# EAGLE schematic VDA (EAGLE 9.6.2)
VERSION: 1.1

## Sheet 1 of 5: Isolated USB-UART Bridge
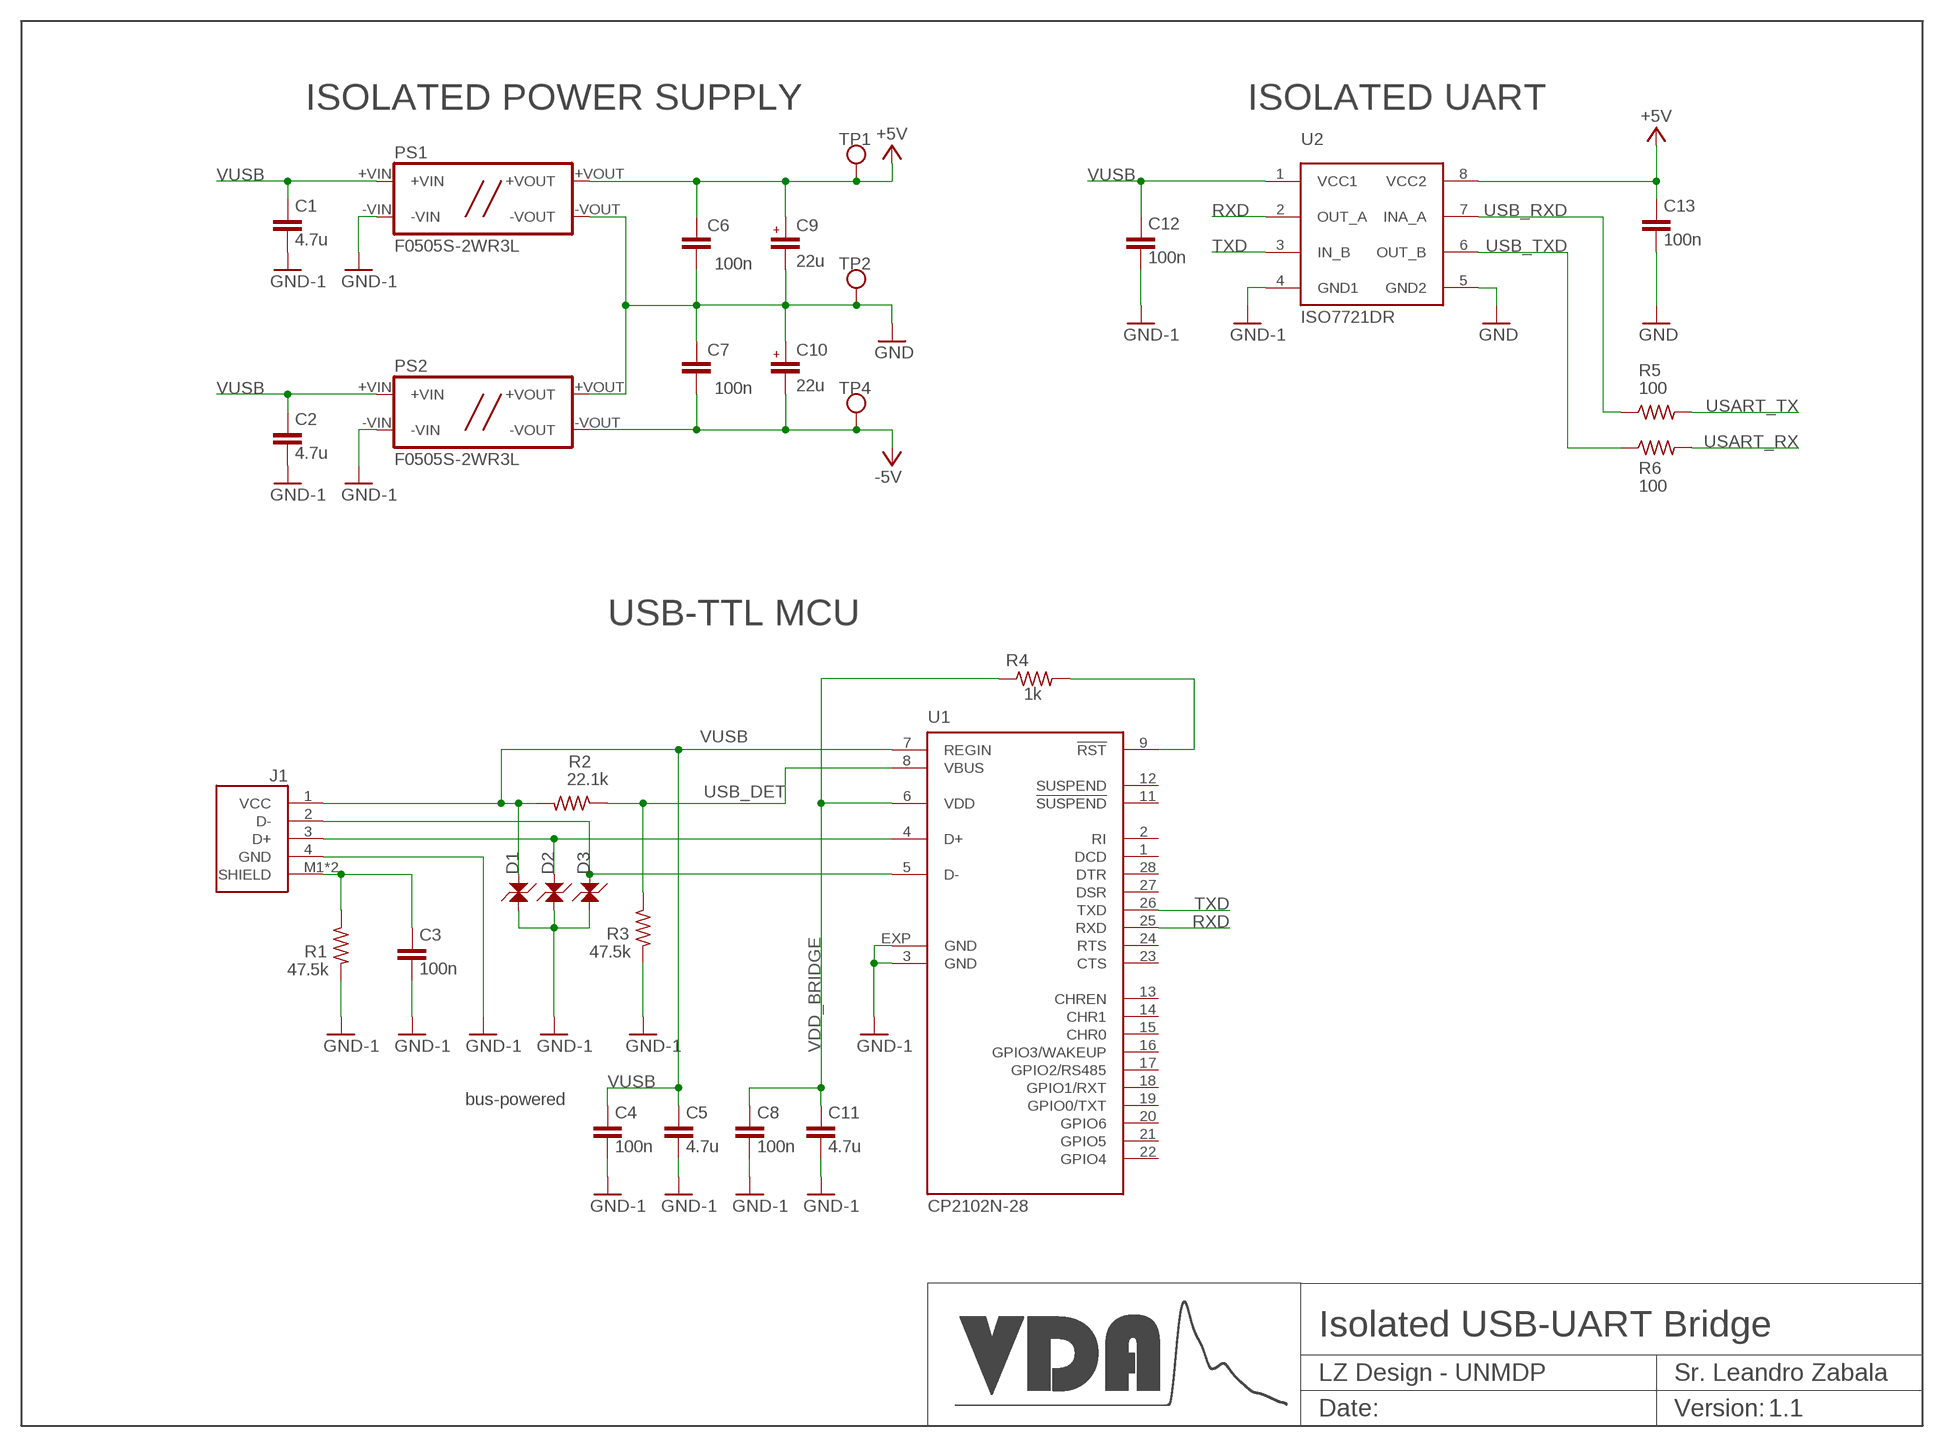
[diagram p0: schematic, sheet 1]

### Parts
C1  4.7u  C_0805  [C_0805]
C2  4.7u  C_0805  [C_0805]
C3  100n  C_0603  [C_0603]
C4  100n  C_0603  [C_0603]
C5  4.7u  C_0805  [C_0805]
C6  100n  C_0603  [C_0603]
C7  100n  C_0603  [C_0603]
C8  100n  C_0603  [C_0603]
C9  22u  C-ELECT-6.3X5.4  [CAPAE660X590N]
C10  22u  C-ELECT-6.3X5.4  [CAPAE660X590N]
C11  4.7u  C_0805  [C_0805]
C12  100n  C_0603  [C_0603]
C13  100n  C_0603  [C_0603]
D1  LESD5D5.0CT1G  [SOD523]
D2  LESD5D5.0CT1G  [SOD523]
D3  LESD5D5.0CT1G  [SOD523]
J1  USB-2.0  [USB-B]
PS1  F0505S-2WR3L  ISOLATED_DCDC  [0505S-2WR3]
PS2  F0505S-2WR3L  ISOLATED_DCDC  [0505S-2WR3]
R1  47.5k  R-US_R0402  [R0402]
R2  22.1k  R-US_R0402  [R0402]
R3  47.5k  R-US_R0402  [R0402]
R4  1k  R-US_R0402  [R0402]
R5  100  R_0603  [R_0603]
R6  100  R_0603  [R_0603]
TP1  HOLE_0.8MM  [HOLE_0.8MM]
TP2  HOLE_0.8MM  [HOLE_0.8MM]
TP4  HOLE_0.8MM  [HOLE_0.8MM]
U1  CP2102N-28  [MLP28]
U2  ISO7721DR  [SO8]

### Nets
+5V: C6.P$1 C9.+ C13.P$1 PS1.+VOUT TP1.1(P) U2.8(VCC2) ; also sheet 2,4,5
-5V: C7.P$2 C10.- PS2.-VOUT TP4.1(P) ; also sheet 4,5
GND: C6.P$2 C7.P$1 C9.- C10.+ C13.P$2 PS1.-VOUT PS2.+VOUT TP2.1(P) U2.5(GND2) ; also sheet 2,3,4,5
GND-1: C1.P$2 C2.P$2 C3.P$2 C4.P$2 C5.P$2 C8.P$2 C11.P$2 C12.P$2 D1.C D2.C D3.C J1.4(GND) PS1.-VIN PS2.-VIN R1.2 R3.2 U1.3(GND) U1.EXP(GND) U2.4(GND1)
N$54: R4.2 U1.9(!RST)
RXD: U1.25(RXD) U2.2(OUT_A)
SHIELD: C3.P$1 J1.M1(SHIELD) J1.M2(SHIELD) R1.1
TXD: U1.26(TXD) U2.3(IN_B)
USART_RX: R6.2 ; also sheet 3
USART_TX: R5.2 ; also sheet 3
USB_DET: R2.1 R3.1 U1.8(VBUS)
USB_DN: D3.A J1.2(D-) U1.5(D-)
USB_DP: D2.A J1.3(D+) U1.4(D+)
USB_RXD: R5.1 U2.7(INA_A)
USB_TXD: R6.1 U2.6(OUT_B)
VDD_BRIDGE: C8.P$1 C11.P$1 R4.1 U1.6(VDD)
VUSB: C1.P$1 C2.P$1 C4.P$1 C5.P$1 C12.P$1 D1.A J1.1(VCC) PS1.+VIN PS2.+VIN R2.2 U1.7(REGIN) U2.1(VCC1)
Unconnected: U1.1(DCD) U1.2(RI) U1.11(!SUSPEND) U1.12(SUSPEND) U1.13(CHREN) U1.14(CHR1) U1.15(CHR0) U1.16(GPIO3/WAKEUP) U1.17(GPIO2/RS485) U1.18(GPIO1/RXT) U1.19(GPIO0/TXT) U1.20(GPIO6) U1.21(GPIO5) U1.22(GPIO4) U1.23(CTS) U1.24(RTS) U1.27(DSR) U1.28(DTR)

### Notes on the sheet
- ISOLATED POWER SUPPLY | ISOLATED UART
- USB-TTL MCU
- bus-powered

## Sheet 2 of 5: LDO and Voltage Reference
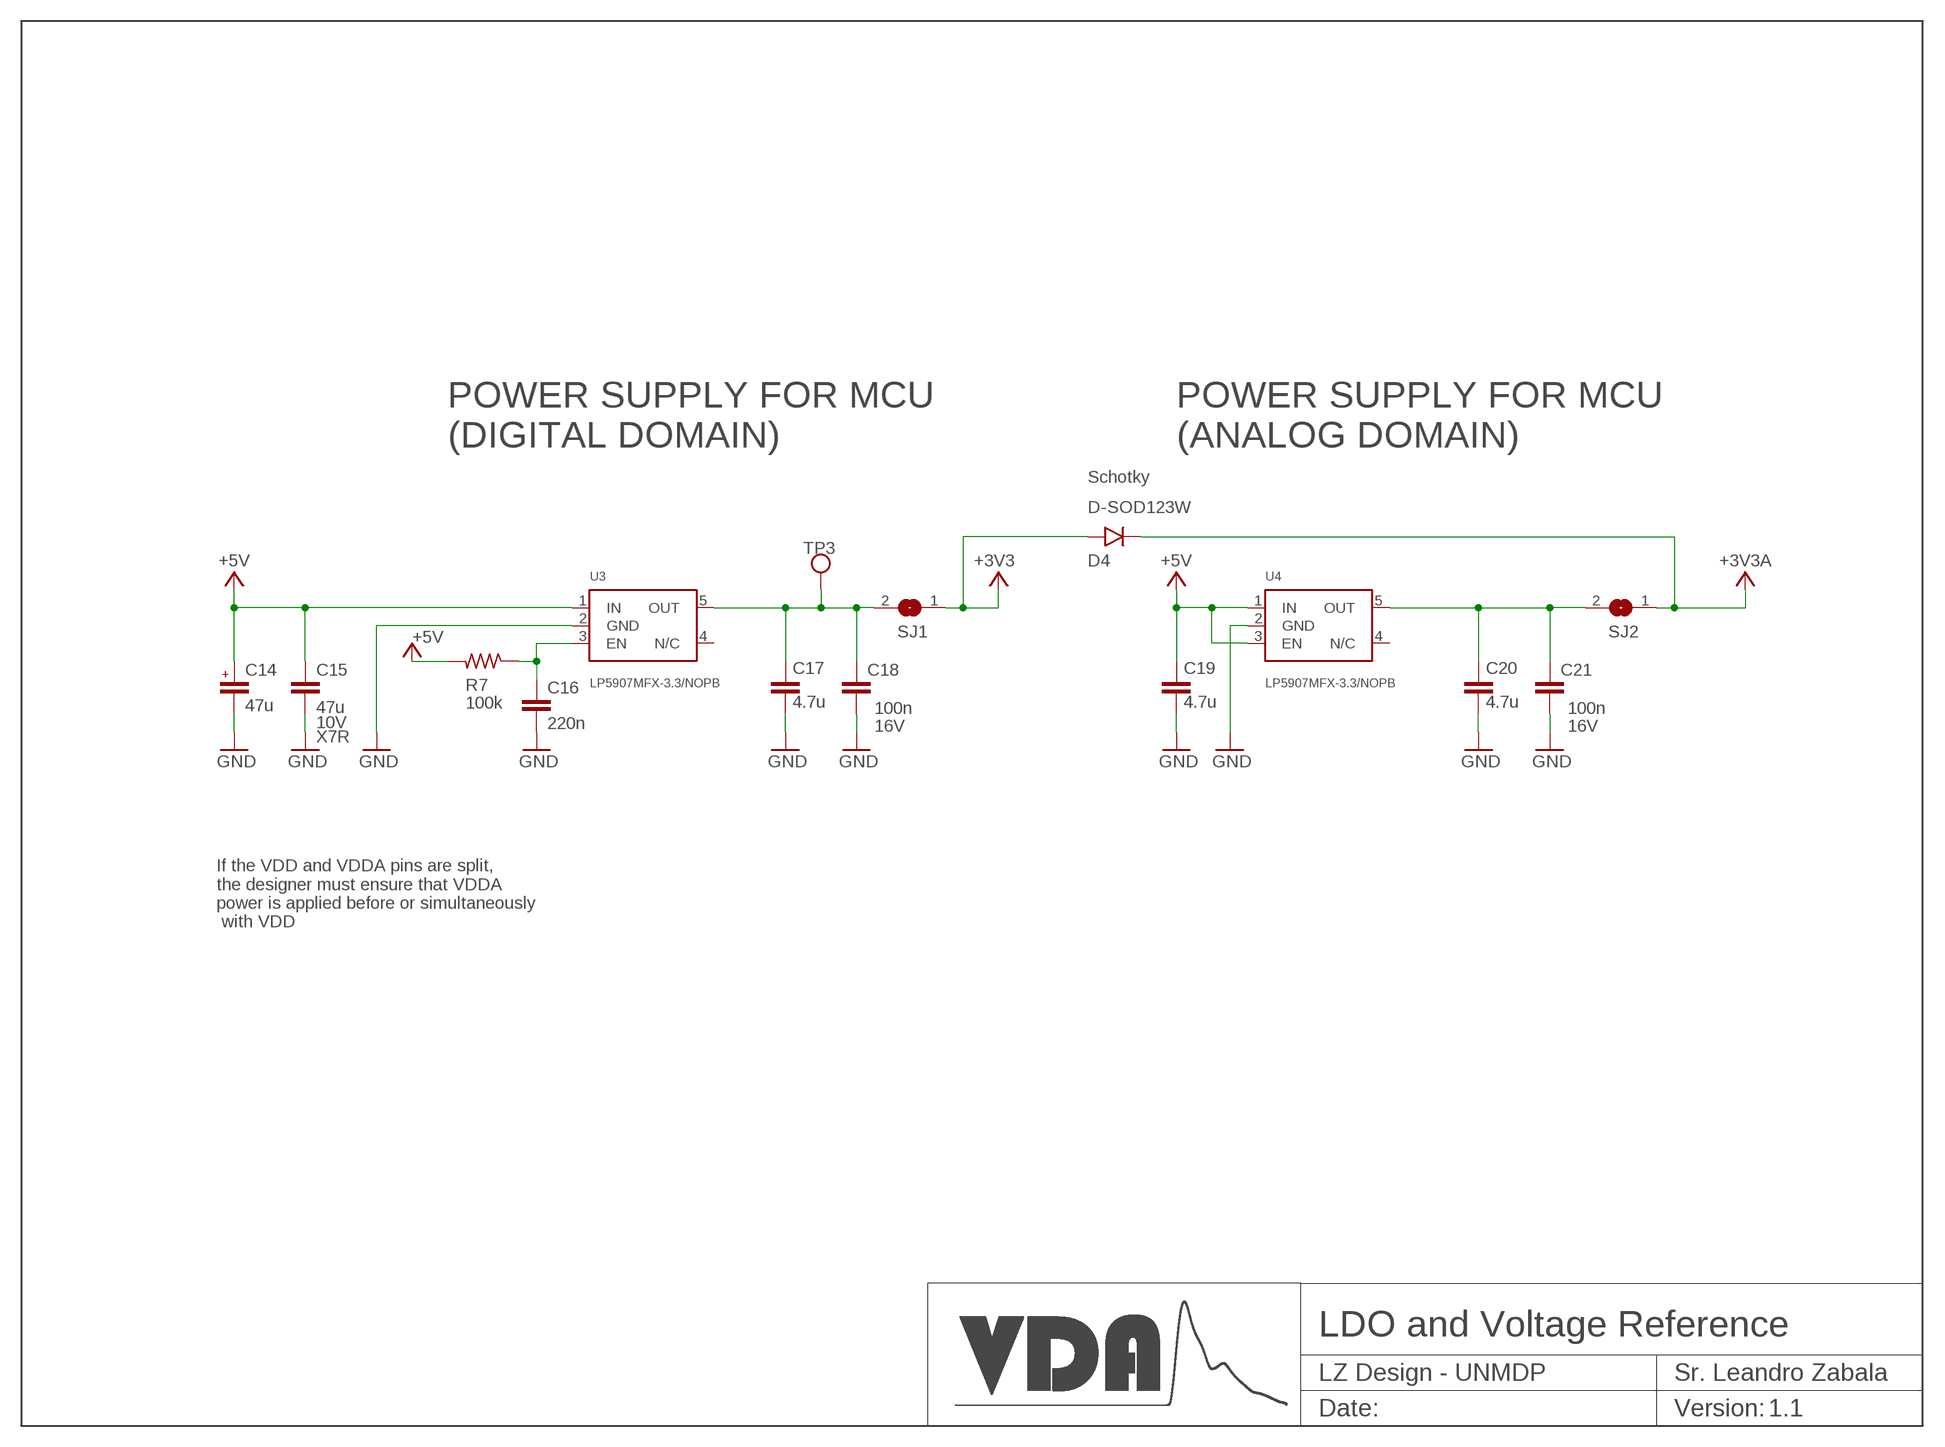
[diagram p1: schematic, sheet 2]

### Parts
C14  47u  C-TANTALUM_A_3216  [A_3216]
C15  47u  C_1206  [C_1206]
C16  220n  C_0603  [C_0603]
C17  4.7u  C_0805  [C_0805]
C18  100n  C_0603  [C_0603]
C19  4.7u  C_0805  [C_0805]
C20  4.7u  C_0805  [C_0805]
C21  100n  C_0603  [C_0603]
D4  D-SOD123W  [SOD123W]
R7  100k  R_0603  [R_0603]
SJ1  SJ  [SJ]
SJ2  SJ  [SJ]
TP3  HOLE_0.8MM  [HOLE_0.8MM]
U3  LP5907MFX-3.3/NOPB  LDO1SOT23-5_1  [SOT23-5]
U4  LP5907MFX-3.3/NOPB  LDO1SOT23-5_1  [SOT23-5]

### Nets
+3V3: D4.A SJ1.1 ; also sheet 3,5
+3V3A: D4.C(K) SJ2.1 ; also sheet 3,4,5
+5V: C14.A(+) C15.P$1 C19.P$1 R7.2 U3.1(IN) U4.1(IN) U4.3(EN) ; also sheet 1,4,5
GND: C14.K(-) C15.P$2 C16.P$2 C17.P$2 C18.P$2 C19.P$2 C20.P$2 C21.P$2 U3.2(GND) U4.2(GND) ; also sheet 1,3,4,5
N$1: C17.P$1 C18.P$1 SJ1.2 TP3.1(P) U3.5(OUT)
N$46: C16.P$1 R7.1 U3.3(EN)
N$50: C20.P$1 C21.P$1 SJ2.2 U4.5(OUT)
Unconnected: U3.4(N/C) U4.4(N/C)

### Notes on the sheet
- POWER SUPPLY FOR MCU
  (DIGITAL DOMAIN)
- POWER SUPPLY FOR MCU
  (ANALOG DOMAIN)
- If the VDD and VDDA pins are split,
  the designer must ensure that VDDA 
  power is applied before or simultaneously
   with VDD

## Sheet 3 of 5: MCU
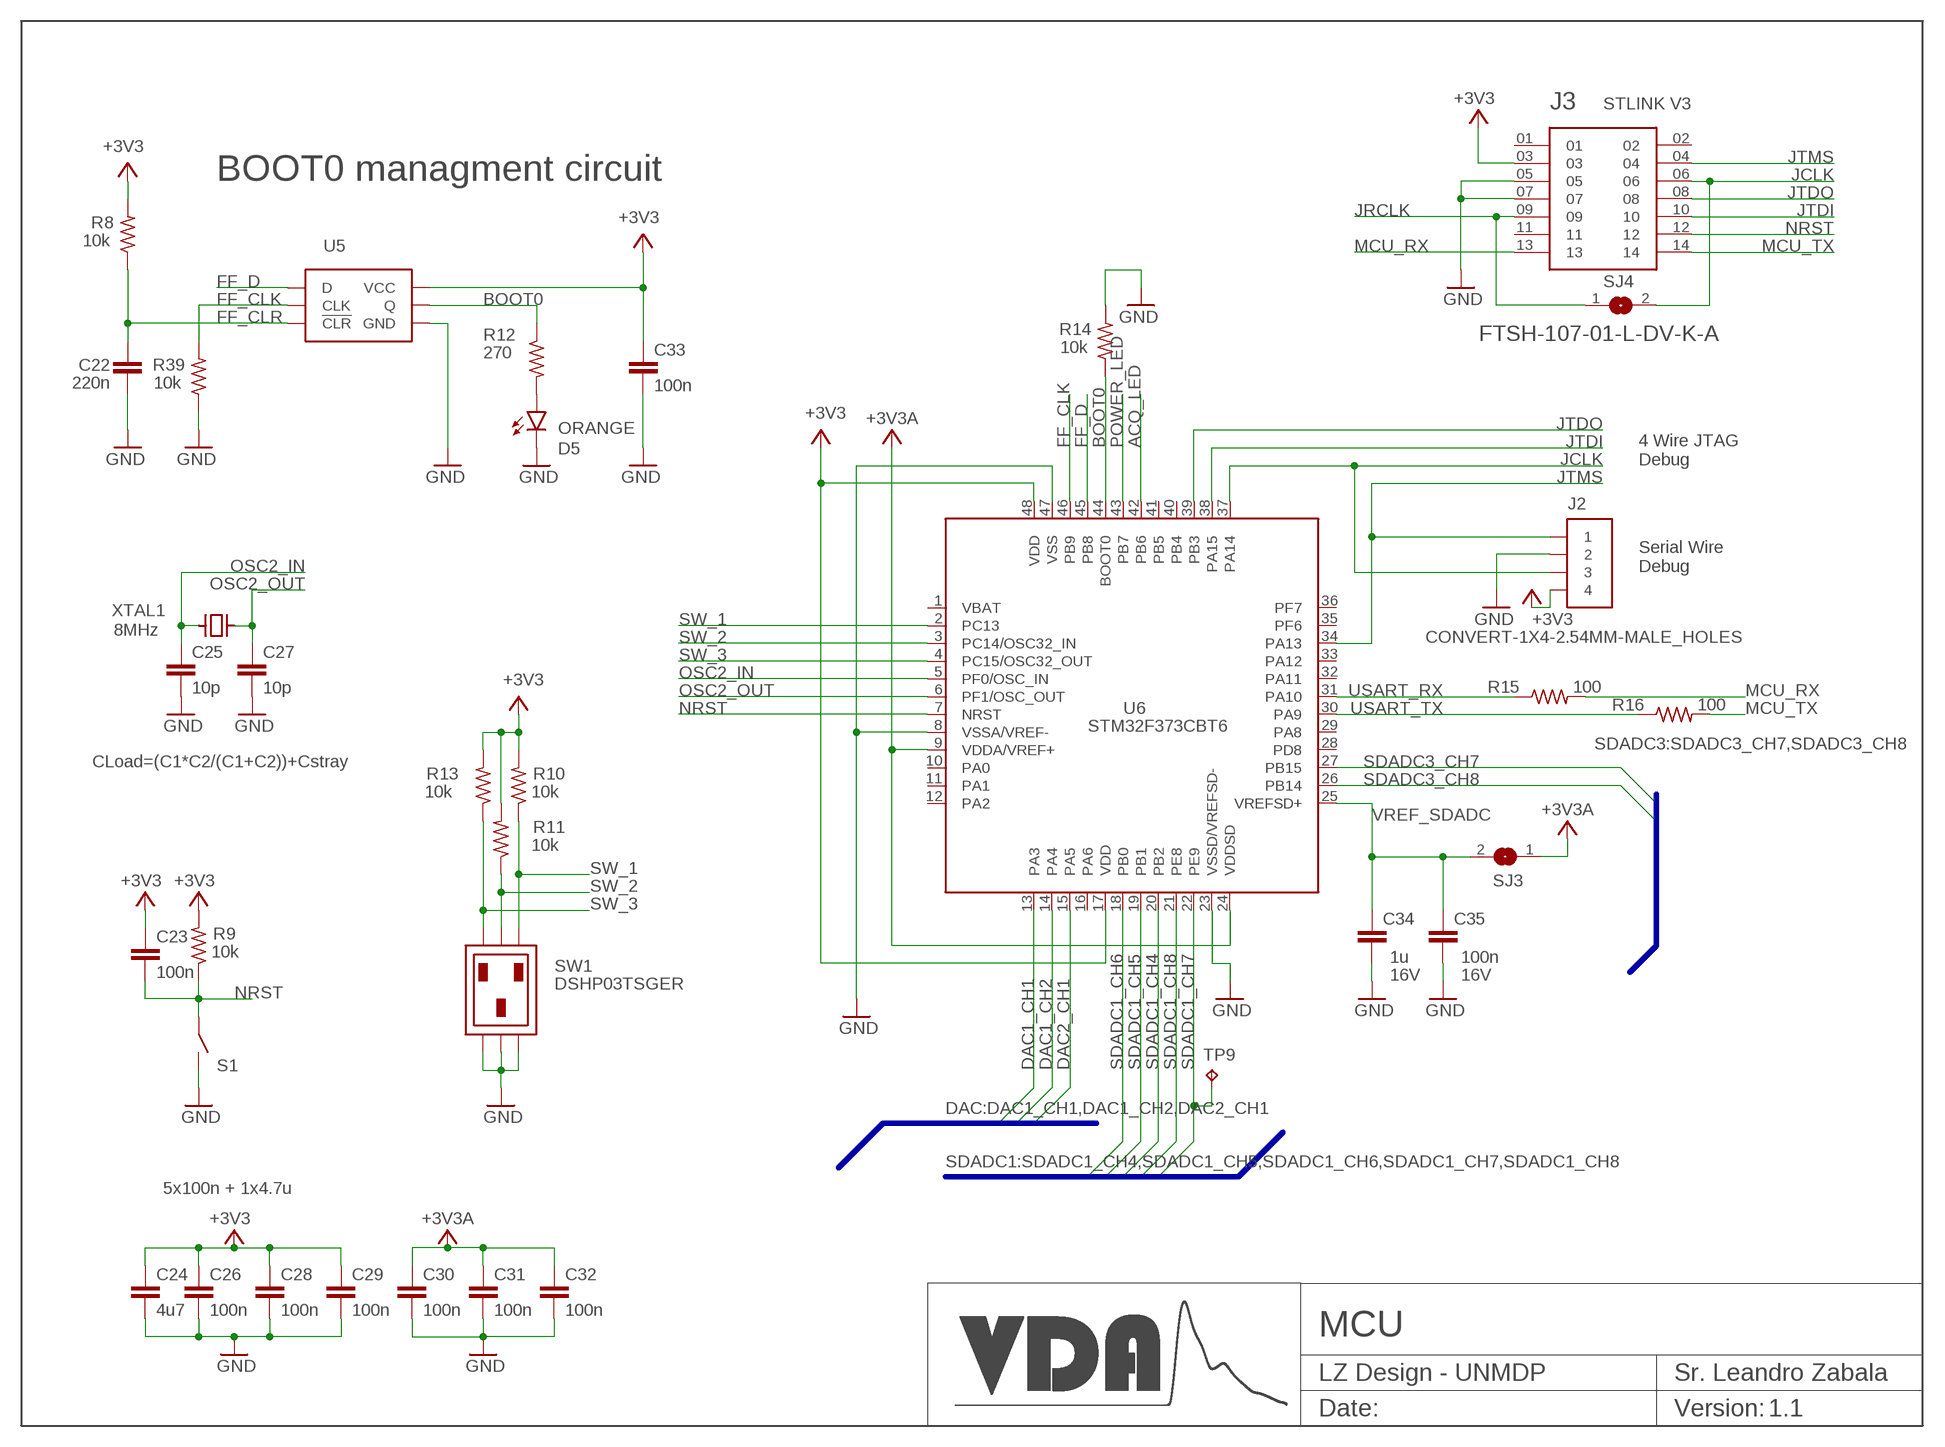
[diagram p2: schematic, sheet 3]

### Parts
C22  220n  C_0603  [C_0603]
C23  100n  C_0603  [C_0603]
C24  4u7  C_0805  [C_0805]
C25  10p  C_0603  [C_0603]
C26  100n  C_0603  [C_0603]
C27  10p  C_0603  [C_0603]
C28  100n  C_0603  [C_0603]
C29  100n  C_0603  [C_0603]
C30  100n  C_0603  [C_0603]
C31  100n  C_0603  [C_0603]
C32  100n  C_0603  [C_0603]
C33  100n  C_0603  [C_0603]
C34  1u  C_0603  [C_0603]
C35  100n  C_0603  [C_0603]
D5  ORANGE  LED_0603_ARROW  [LED_0603_ARROW]
J2  CONVERT-1X4-2.54MM-MALE_HOLES  [1X04]
J3  FTSH-107-01-L-DV-K-A  [SAMTEC_FTSH-107-01-L-DV-K-A]
R8  10k  R_0603  [R_0603]
R9  10k  R_0603  [R_0603]
R10  10k  R_0603  [R_0603]
R11  10k  R_0603  [R_0603]
R12  270  R_0603  [R_0603]
R13  10k  R_0603  [R_0603]
R14  10k  R_0603  [R_0603]
R15  100  R_0603  [R_0603]
R16  100  R_0603  [R_0603]
R39  10k  R_0603  [R_0603]
S1  TSWITCH_SMTR2  [SMTR2]
SJ3  SJ  [SJ]
SJ4  SJ  [SJ]
SW1  DSHP03TSGER  DIPSW-3  [DIPSW-3]
TP9  TPTP16R  [TP16R]
U5  SN74LVC1G175  [SOT-23-6]
U6  STM32F373CBT6  STM32F373-48CT  [QFP50P900X900X160-48N]
XTAL1  8MHz  XTAL3.2X2.5  [XTAL3.2X2.5]

### Nets
+3V3: C23.P$1 C24.P$1 C26.P$1 C28.P$1 C29.P$1 C33.P$1 J2.4 J3.03 R8.2 R9.2 R10.2 R11.2 R13.2 U5.5(VCC) U6.17(VDD) U6.48(VDD) ; also sheet 2,5
+3V3A: C30.P$1 C31.P$1 C32.P$1 SJ3.1 U6.9(VDDA/VREF+) U6.24(VDDSD) ; also sheet 2,4,5
ACQ_LED: U6.42(PB6) ; also sheet 5
BOOT0: R12.1 R14.1 U5.4(Q) U6.44(BOOT0) ; also sheet 5
DAC1_CH1: U6.13(PA3) ; also sheet 4
DAC1_CH2: U6.14(PA4) ; also sheet 5
DAC2_CH1: U6.15(PA5) ; also sheet 5
FF_CLK: R39.2 U5.1(CLK) U6.46(PB9)
FF_CLR: C22.P$1 R8.1 U5.6(!CLR!)
FF_D: U5.3(D) U6.45(PB8)
GND: C22.P$2 C24.P$2 C25.P$2 C26.P$2 C27.P$2 C28.P$2 C29.P$2 C30.P$2 C31.P$2 C32.P$2 C33.P$2 C34.P$2 C35.P$2 D5.K J2.2 J3.05 J3.07 R14.2 R39.1 S1.P$3 S1.P$4 SW1.P$2 SW1.P$4 SW1.P$6 U5.2(GND) U6.8(VSSA/VREF-) U6.23(VSSD/VREFSD-) U6.47(VSS) ; also sheet 1,2,4,5
JCLK: J2.3 J3.06 SJ4.2 U6.37(PA14)
JRCLK: J3.09 SJ4.1
JTDI: J3.10 U6.38(PA15)
JTDO: J3.08 U6.39(PB3)
JTMS: J2.1 J3.04 U6.34(PA13)
MCU_RX: J3.13 R15.2
MCU_TX: J3.14 R16.2
N$15: D5.A R12.2
NRST: C23.P$2 J3.12 R9.1 S1.P$1 S1.P$2 U6.7(NRST)
OSC2_IN: C25.P$1 U6.5(PF0/OSC_IN) XTAL1.P$3(X2)
OSC2_OUT: C27.P$1 U6.6(PF1/OSC_OUT) XTAL1.P$1(X1)
POWER_LED: U6.43(PB7) ; also sheet 5
SDADC1_CH4: U6.20(PB2) ; also sheet 5
SDADC1_CH5: U6.19(PB1) ; also sheet 4
SDADC1_CH6: U6.18(PB0) ; also sheet 4
SDADC1_CH7: TP9.TP U6.22(PE9)
SDADC1_CH8: U6.21(PE8) ; also sheet 5
SDADC3_CH7: U6.27(PB15) ; also sheet 5
SDADC3_CH8: U6.26(PB14) ; also sheet 5
SW_1: R10.1 SW1.P$1 U6.2(PC13)
SW_2: R11.1 SW1.P$3 U6.3(PC14/OSC32_IN)
SW_3: R13.1 SW1.P$5 U6.4(PC15/OSC32_OUT)
USART_RX: R15.1 U6.31(PA10) ; also sheet 1
USART_TX: R16.1 U6.30(PA9) ; also sheet 1
VREF_SDADC: C34.P$1 C35.P$1 SJ3.2 U6.25(VREFSD+)
Unconnected: J3.01 J3.02 J3.11 U6.10(PA0) U6.11(PA1) U6.12(PA2) U6.16(PA6) U6.28(PD8) U6.29(PA8) U6.32(PA11) U6.33(PA12) U6.35(PF6) U6.36(PF7) U6.40(PB4) U6.41(PB5)

### Buses
SDADC1:SDADC1_CH4,SDADC1_CH5,SDADC1_CH6,SDADC1_CH7,SDADC1_CH8
DAC:DAC1_CH1,DAC1_CH2,DAC2_CH1
SDADC3:SDADC3_CH7,SDADC3_CH8

### Notes on the sheet
- STLINK V3
- BOOT0 managment circuit
- 4 Wire JTAG
  Debug
- Serial Wire 
  Debug
- CLoad=(C1*C2/(C1+C2))+Cstray
- 5x100n + 1x4.7u

## Sheet 4 of 5: Front End
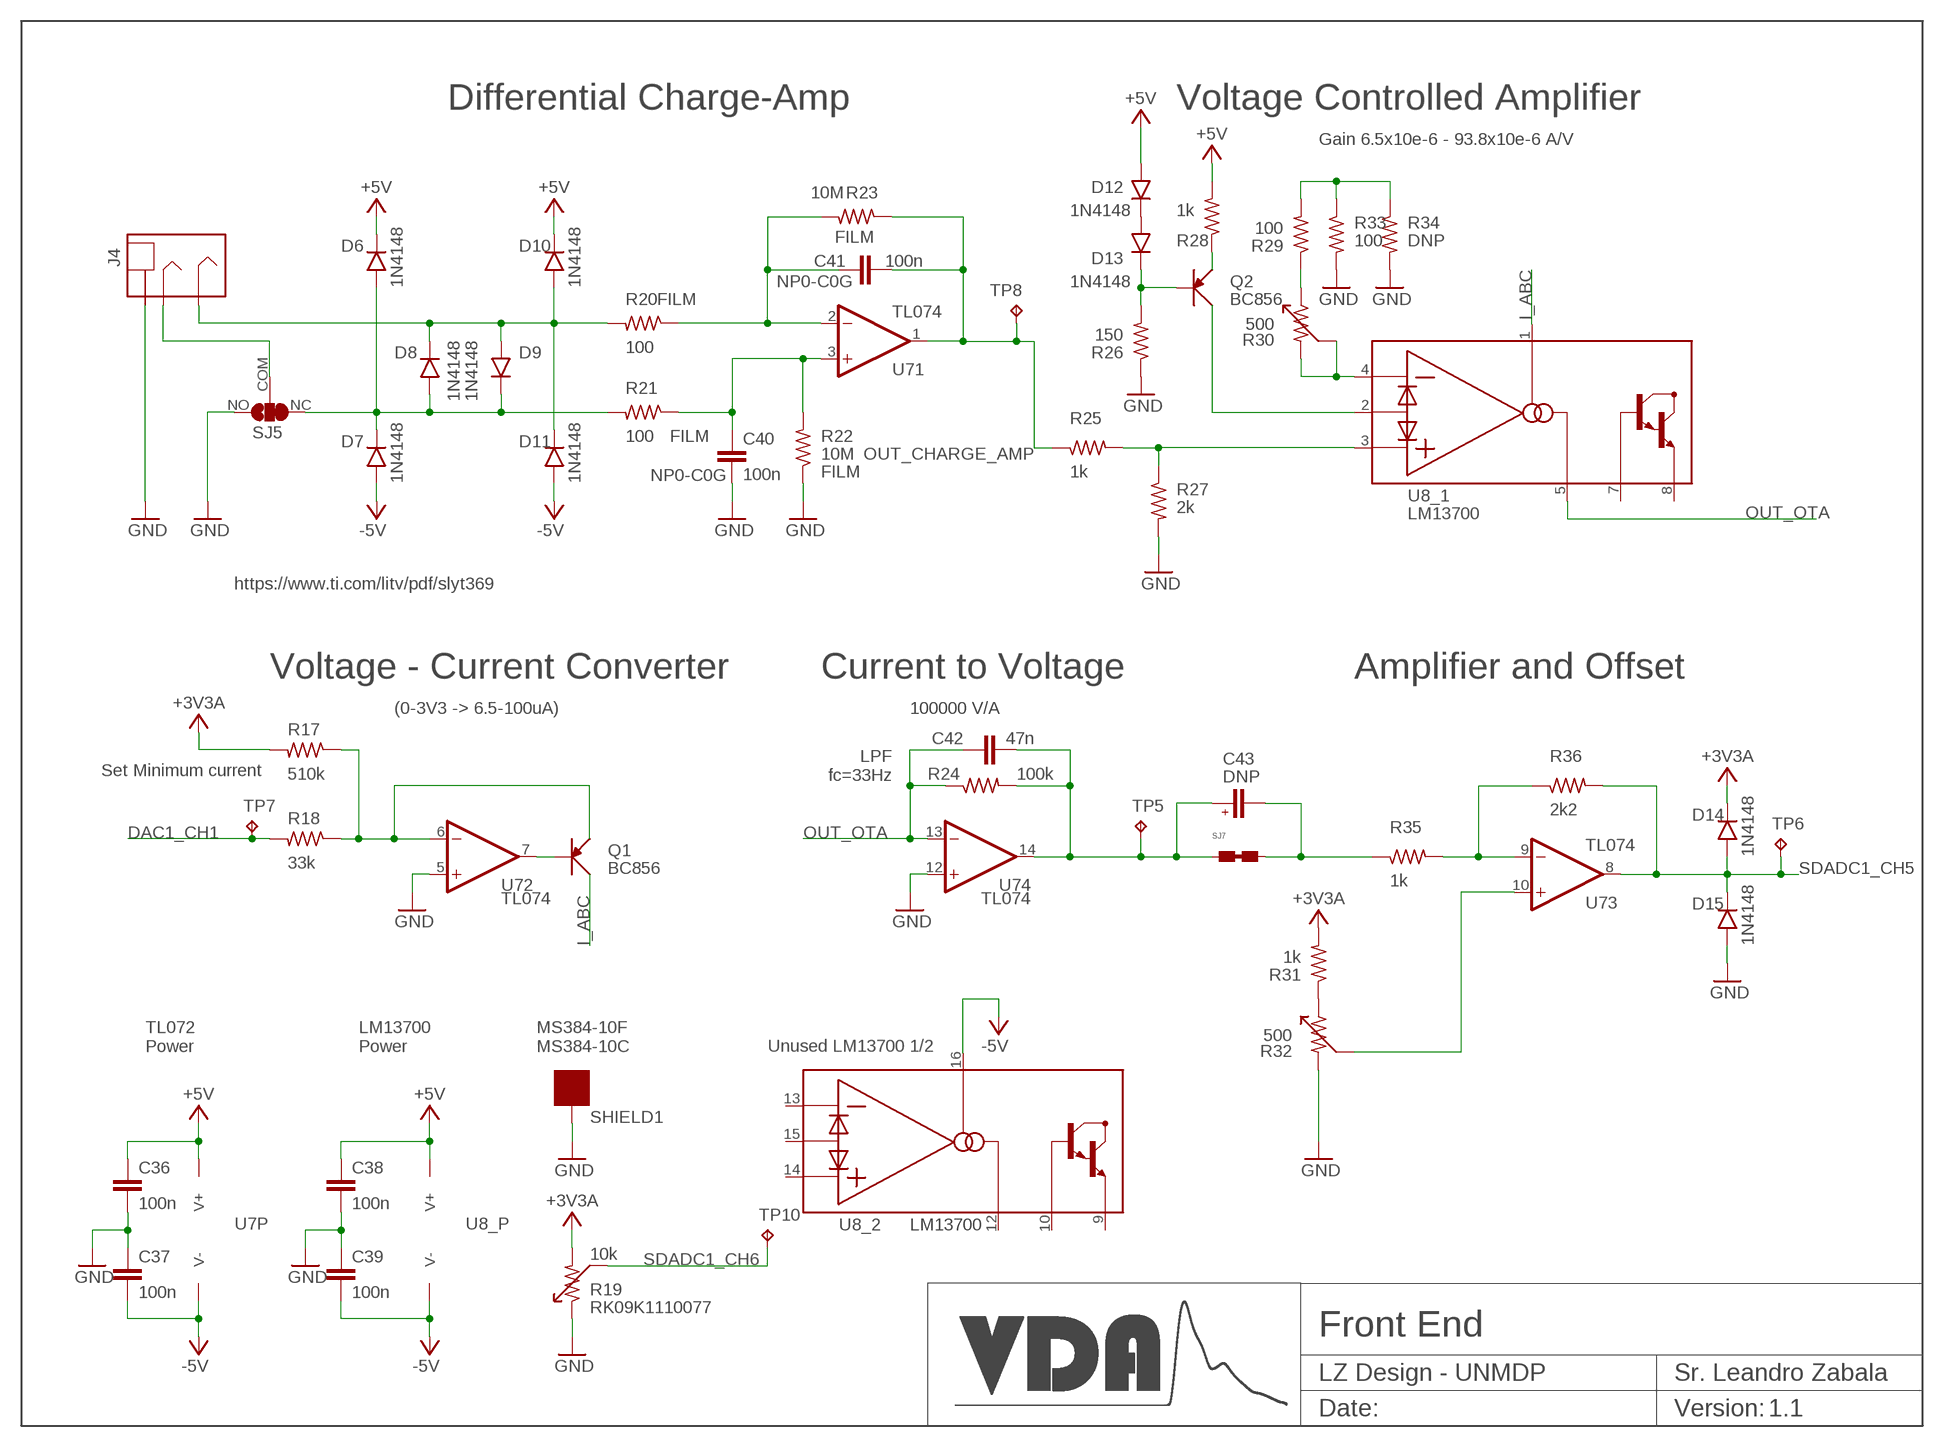
[diagram p3: schematic, sheet 4]

### Parts
C36  100n  C_0603  [C_0603]
C37  100n  C_0603  [C_0603]
C38  100n  C_0603  [C_0603]
C39  100n  C_0603  [C_0603]
C40  100n  C_1206  [C_1206]
C41  100n  C_1206  [C_1206]
C42  47n  C_0603  [C_0603]
C43  DNP  C-ELECT_D8L6.5  [CAPAE830X680N]
D6  1N4148  D-SOD123W  [SOD123W]
D7  1N4148  D-SOD123W  [SOD123W]
D8  1N4148  D-SOD123W  [SOD123W]
D9  1N4148  D-SOD123W  [SOD123W]
D10  1N4148  D-SOD123W  [SOD123W]
D11  1N4148  D-SOD123W  [SOD123W]
D12  1N4148  D-SOD123W  [SOD123W]
D13  1N4148  D-SOD123W  [SOD123W]
D14  1N4148  D-SOD123W  [SOD123W]
D15  1N4148  D-SOD123W  [SOD123W]
J4  STEREO-JACK  [PJ-3200]
Q1  BC856  PNP_SOT23  [SOT-23]
Q2  BC856  PNP_SOT23  [SOT-23]
R17  510k  R_0603  [R_0603]
R18  33k  R_0603  [R_0603]
R19  10k  R-VARIABLE09VR1B  [POT-09VR1M]
R20  100  R_0603  [R_0603]
R21  100  R_0603  [R_0603]
R22  10M  R_0603  [R_0603]
R23  10M  R_0603  [R_0603]
R24  100k  R_0603  [R_0603]
R25  1k  R_0603  [R_0603]
R26  150  R_0603  [R_0603]
R27  2k  R_0603  [R_0603]
R28  1k  R_0603  [R_0603]
R29  100  R_0603  [R_0603]
R30  500  R-VARIABLE-3.2X4  [RV3.2X4]
R31  1k  R_0603  [R_0603]
R32  500  R-VARIABLE-3.2X4  [RV3.2X4]
R33  100  R_0603  [R_0603]
R34  DNP  R_0603  [R_0603]
R35  1k  R_0603  [R_0603]
R36  2k2  R_0603  [R_0603]
SHIELD1  MS384  [MS384]
SJ5  SJ-PSS  [SJ_2S]
SJ7  SJUMPER-NC  [SJ1]
TP5  TPTP16R  [TP16R]
TP6  TPTP16R  [TP16R]
TP7  TPTP16R  [TP16R]
TP8  TPTP16R  [TP16R]
TP10  TPTP16R  [TP16R]
U7  TL074  LM324BD  [SOIC127P600X175-14N]
U8  LM13700  [SO16]

### Nets
+3V3A: D14.C(K) R17.2 R19.P$3 R31.2 ; also sheet 2,3,5
+5V: C36.P$1 C38.P$1 D6.C(K) D10.C(K) D12.A R28.2 U7.4(P:V+) U8.11(_P:V+) ; also sheet 1,2,5
-5V: C37.P$2 C39.P$2 D7.A D11.A U7.11(P:V-) U8.6(_P:V-) U8.16(_2:AMP_BIAS) ; also sheet 1,5
DAC1_CH1: R18.2 TP7.TP ; also sheet 3
GND: C36.P$2 C37.P$1 C38.P$2 C39.P$1 C40.P$2 D15.A J4.1(SLEEVE) R19.P$1 R22.1 R26.1 R27.2 R32.3 R33.2 R34.2 SHIELD1.P$1 SHIELD1.P$2 SJ5.NO U7.5(2:+IN) U7.12(4:+IN) ; also sheet 1,2,3,5
I_ABC: Q1.3(C) U8.1(_1:AMP_BIAS)
N$2: C42.P$1 C43.1(+) R24.2 SJ7.P$1 TP5.TP U7.14(4:OUT)
N$3: C40.P$1 R21.1 R22.2 U7.3(1:+IN)
N$4: C41.P$1 R20.1 R23.2 U7.2(1:-IN)
N$5: C43.2(-) R35.1 SJ7.P$2
N$6: J4.3(RING) SJ5.COM
N$7: Q1.2(E) R17.1 R18.1 U7.6(2:-IN)
N$9: R29.2 R33.1 R34.1
N$10: Q1.1(B) U7.7(2:OUT)
N$11: Q2.2(E) R28.1
N$12: D12.C(K) D13.A
N$13: R31.1 R32.1
N$16: D8.C(K) D9.A D10.A D11.C(K) J4.2(TIP) R20.2
N$17: D6.A D7.C(K) D8.A D9.C(K) R21.2 SJ5.NC
N$18: R32.2(C) U7.10(3:+IN)
N$19: R25.2 R27.1 U8.3(_1:+)
N$20: R30.2(C) R30.3 U8.4(_1:-)
N$21: Q2.3(C) U8.2(_1:D_BIAS)
N$22: R29.1 R30.1
N$24: D13.C(K) Q2.1(B) R26.2
N$27: R35.2 R36.1 U7.9(3:-IN)
OUT_CHARGE_AMP: C41.P$2 R23.1 R25.1 TP8.TP U7.1(1:OUT)
OUT_OTA: C42.P$2 R24.1 U7.13(4:-IN) U8.5(_1:OUT)
SDADC1_CH5: D14.A D15.C(K) R36.2 TP6.TP U7.8(3:OUT) ; also sheet 3
SDADC1_CH6: R19.P$2(C) TP10.TP ; also sheet 3
Unconnected: U8.7(_1:B) U8.8(_1:E) U8.9(_2:E) U8.10(_2:B) U8.12(_2:OUT) U8.13(_2:-) U8.14(_2:+) U8.15(_2:D_BIAS)

### Notes on the sheet
- Differential Charge-Amp | Voltage Controlled Amplifier
- Gain 6.5x10e-6 - 93.8x10e-6 A/V
- https://www.ti.com/litv/pdf/slyt369
- Voltage - Current Converter | Current to Voltage | Amplifier and Offset
- (0-3V3 -> 6.5-100uA) | 100000 V/A
- LPF
  fc=33Hz
- Set Minimum current
- TL072
  Power
- LM13700
  Power
- MS384-10F
  MS384-10C
- Unused LM13700 1/2

## Sheet 5 of 5: Status LEDs & Expansion Connectors
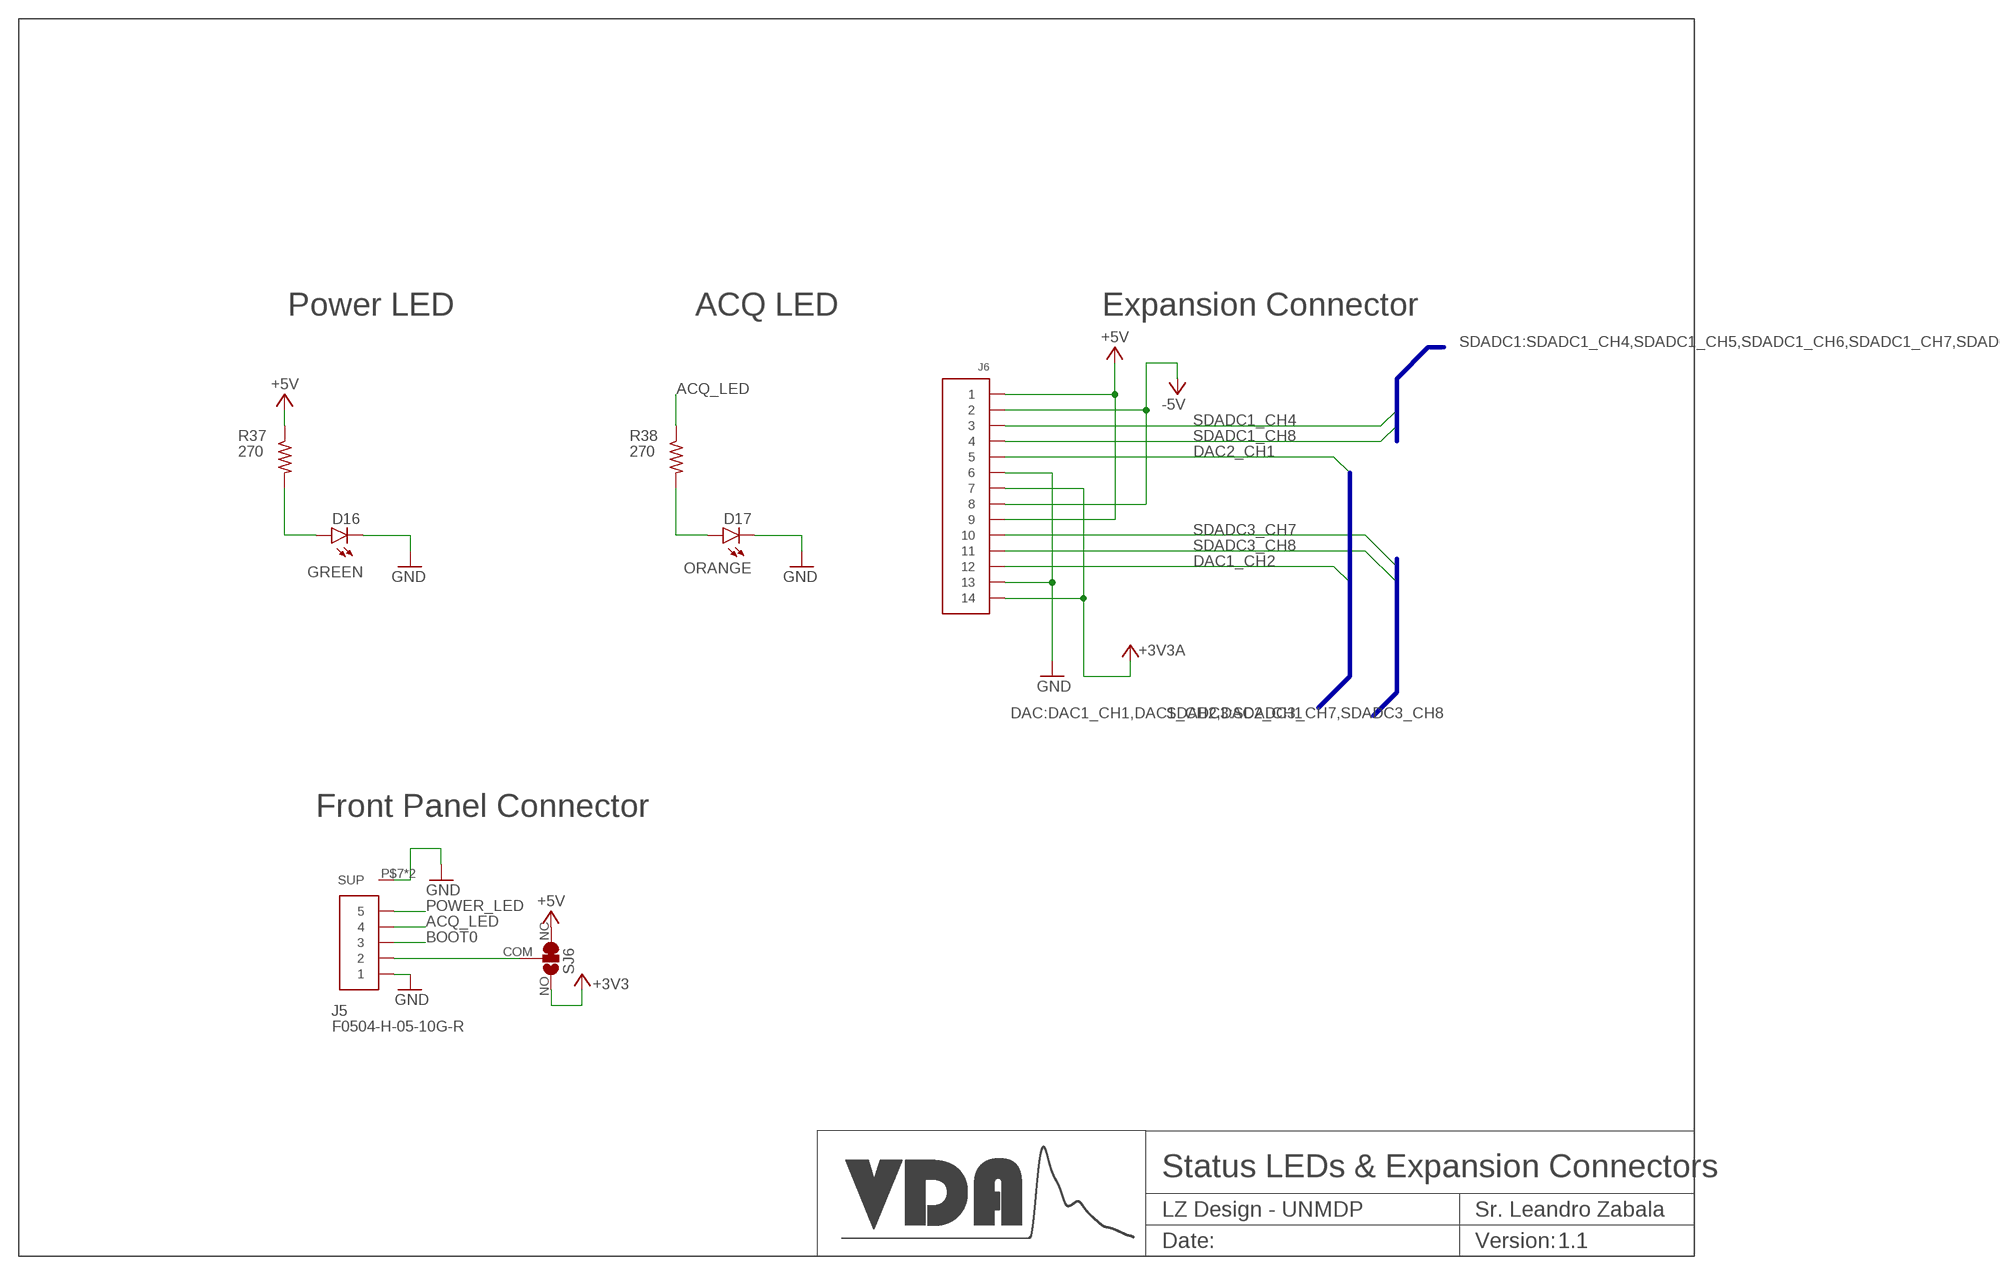
[diagram p4: schematic, sheet 5]

### Parts
D16  GREEN  LED_0603_ARROW  [LED_0603_ARROW]
D17  ORANGE  LED_0603_ARROW  [LED_0603_ARROW]
J5  F0504-H-05-10G-R  [F0504-H-05-10G-R]
J6  CONVERT-2X7-2.54MM-FEMALE  [CONN-VERT-2.54MM-2X7-FEMALE]
R37  270  R_0603  [R_0603]
R38  270  R_0603  [R_0603]
SJ6  SJ-PSS  [SJ_2S]

### Nets
+3V3: SJ6.NO ; also sheet 2,3
+3V3A: J6.7 J6.14 ; also sheet 2,3,4
+5V: J6.1 J6.9 R37.1 SJ6.NC ; also sheet 1,2,4
-5V: J6.2 J6.8 ; also sheet 1,4
ACQ_LED: J5.P$4 R38.1 ; also sheet 3
BOOT0: J5.P$3 ; also sheet 3
DAC1_CH2: J6.12 ; also sheet 3
DAC2_CH1: J6.5 ; also sheet 3
GND: D16.K D17.K J5.P$1 J5.P$7(SUP) J5.P$8(SUP) J6.6 J6.13 ; also sheet 1,2,3,4
N$8: D17.A R38.2
N$14: D16.A R37.2
N$23: J5.P$2 SJ6.COM
POWER_LED: J5.P$5 ; also sheet 3
SDADC1_CH4: J6.3 ; also sheet 3
SDADC1_CH8: J6.4 ; also sheet 3
SDADC3_CH7: J6.10 ; also sheet 3
SDADC3_CH8: J6.11 ; also sheet 3

### Buses
SDADC1:SDADC1_CH4,SDADC1_CH5,SDADC1_CH6,SDADC1_CH7,SDADC1_CH8
DAC:DAC1_CH1,DAC1_CH2,DAC2_CH1
SDADC3:SDADC3_CH7,SDADC3_CH8

### Notes on the sheet
- Power LED | ACQ LED | Expansion Connector
- Front Panel Connector

## Power pins joined to a net without a drawn wire
VBAT: U6.1(VBAT)

## Library data of the parts
C1-C8 C11-C13 C16 C17 C19 C20 C22-C33 C36-C39 C42 = Property-standar:C
C9 C10 C43 = Property-standar:C-ELECT
C14 = Property-standar:C-TANTALUM
C15 = Property-standar:C; D: X7R; ESR: LOW; V: 10V
C18 C21 C34 C35 = Property-standar:C; V: 16V
C40 C41 = Property-standar:C; DESCRIPTION: NP0-C0G
D1-D3 = property:LESD5D5.0CT1G
D4 = Property-standar:D; TYPE: Schotky
D5 D16 D17 = Property-standar:LED
D6-D15 = Property-standar:D
J1 = Connectors:USB-2.0
J2 = property-connectors:CONVERT-1X4-2.54MM-MALE
J3 = property-connectors:FTSH-107-01-L-DV-K-A: High Reliability Header Strips, 0.050" pitch; MANUFACTURER: Samtec; MAXIMUM_PACKAGE_HEIGHT: 6.23mm; PARTREV: H; STANDARD: Manufacturer Recommendation
J4 = Connectors:STEREO-JACK
J5 = property-connectors:F0504-H-05-10G-R: FFC, FPC (Flat Flexible) Connector SMD,P=0.5mm,Surface Mount，Right Angle
J6 = property-connectors:CONVERT-2X7-2.54MM-FEMALE
PS1 PS2 = Power-Supply:ISOLATED_DCDC
Q1 Q2 = Property-standar:PNP
R1-R4 = resistor:R-US_: RESISTOR, American symbol
R5-R18 R24-R29 R31 R33-R39 = Property-standar:R
R19 = Property-standar:R-VARIABLE; MPN: RK09K1110077
R20-R23 = Property-standar:R; DESCRIPTION: FILM
R30 R32 = Property-standar:R-VARIABLE; MPN: 3224W-1-501E
S1 = property:TSWITCH
SHIELD1 = shields:MS384
SJ1-SJ4 = jumper:SJ: SMD solder JUMPER
SJ5 SJ6 = property-pads:SJ-PS: SMD solder JUMPER
SJ7 = properti-mechanical:SJUMPER-NC
SW1 = properti-mechanical:DIPSW-3
TP1-TP4 = property-connectors:HOLE
TP5-TP10 = property-pads:TP: Test pad
U1 = property:CP2102N-28
U2 = property_digital:ISO7721DR
U3 U4 = property-power:LDO1
U5 = property_digital:SN74LVC1G175
U6 = property:STM32F373-48
U7 = property:LM324B: OP AMP also LM158; LM258; LM2904 Source: http://cache.national.com/ds/LM/LM158.pdf
U8 = property_analog:LM13700
XTAL1 = property:XTAL; MPN: 830108313809